# EAGLE design master (EAGLE 9.6.2)
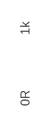
[diagram p0: schematic, sheet 1, part 1 of 2]
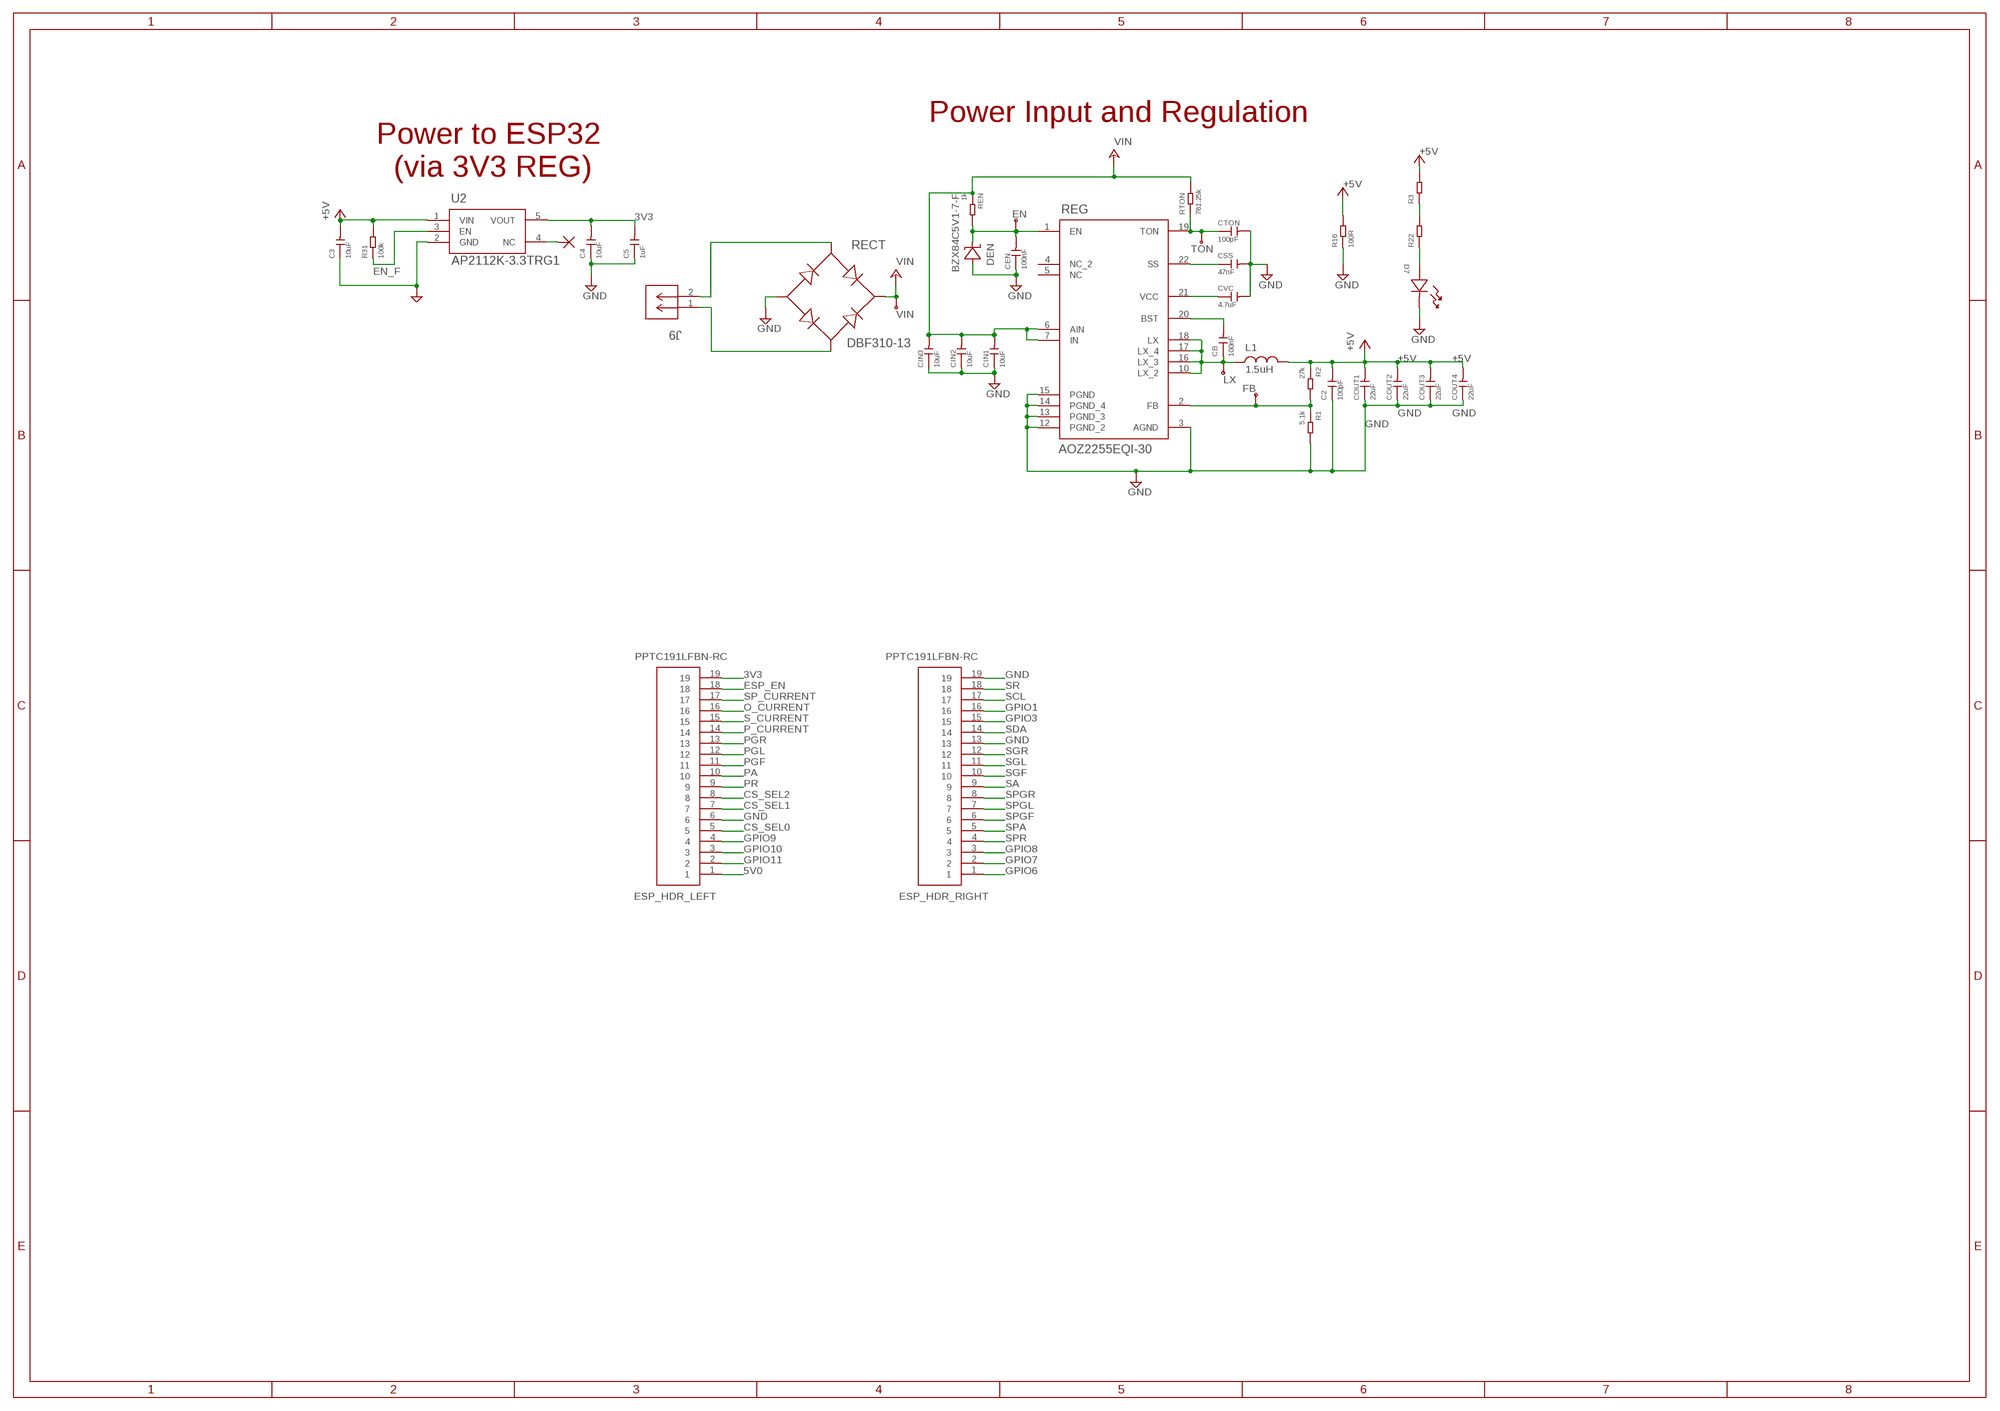
[diagram p1: schematic, sheet 1, part 2 of 2]

## Parts
C2  100pF  CERAMIC-1NF-50V-5%-C0G(0603)  [C0603]
C3  10uF  CERAMIC-4.7UF-25V-10%-X5R(0805)  [C0805]
C4  10uF  CERAMIC-4.7UF-25V-10%-X5R(0805)  [C0805]
C5  1uF  CERAMIC-1NF-50V-10%-X7R(0603)  [C0603]
CB  100nF  CERAMIC-1NF-50V-5%-C0G(0603)  [C0603]
CEN  100nF  CERAMIC-1NF-50V-5%-C0G(0603)  [C0603]
CIN1  10uF  CERAMIC-4.7UF-25V-10%-X5R(0805)  [C0805]
CIN2  10uF  CERAMIC-4.7UF-25V-10%-X5R(0805)  [C0805]
CIN3  10uF  CERAMIC-4.7UF-25V-10%-X5R(0805)  [C0805]
COUT1  22uF  CERAMIC-10UF-25V-10%-X5R(1206)  [C1206]
COUT2  22uF  CERAMIC-10UF-25V-10%-X5R(1206)  [C1206]
COUT3  22uF  CERAMIC-10UF-25V-10%-X5R(1206)  [C1206]
COUT4  22uF  CERAMIC-10UF-25V-10%-X5R(1206)  [C1206]
CSS  47nF  CERAMIC-1NF-50V-10%-X7R(0603)  [C0603]
CTON  100pF  CERAMIC-1.5PF-50V-0.1PF-NPO(0402)  [C0402]
CVC  4.7uF  CERAMIC-390PF-50V-10%-X7R(0402)  [C0402]
D7  VLMY1500-GS08  [LED_1500-GS08_VIS]
DEN  BZX84C5V1-7-F  ZENER_SOT23  [SOT23]
EN  CONN_HDR_1POS_0.1  [1X1]
ESP_HDR_LEFT  PPTC191LFBN-RC  [RHDR19W80P0X254_1X19_4876X254X]
ESP_HDR_RIGHT  PPTC191LFBN-RC  [RHDR19W80P0X254_1X19_4876X254X]
FB  CONN_HDR_1POS_0.1  [1X1]
J9  1715250000  [CONN2_250000_WED]
L1  1.5uH  BCIH1367-2R2M  [BCIH1367-2R2M]
LX  CONN_HDR_1POS_0.1  [1X1]
R1  5.1k  SMD-RES-0R-1%-1/10W(0603)  [R0603]
R2  27k  SMD-RES-0R-1%-1/10W(0603)  [R0603]
R3  1k  SMD-RES-1.5K-1%-1/16W(0402)  [R0402]
R16  100R  DIP-RES-(PR-D2.7XL8.5MM)  [PR-D2.7XL8.5MM]
R22  0R  SMD-RES-1.5K-1%-1/16W(0402)  [R0402]
R31  100k  SMD-RES-1.5K-1%-1/16W(0402)  [R0402]
RECT  DBF310-13  [DBF_DIO]
REG  AOZ2255EQI-30  AOZ2255LQI-31  [QFN_4X4_22L-EP2_S_AOS]
REN  1k  SMD-RES-1.2K-1%-1/10W(0603)  [R0603]
RTON  781.25k  SMD-RES-0R-1%-1/10W(0603)  [R0603]
TON  CONN_HDR_1POS_0.1  [1X1]
U2  AP2112K-3.3TRG1  [SOT_RG1_DIO]
U$3  NC_MARKER  (no package)
VIN  CONN_HDR_1POS_0.1  [1X1]

## Nets
3V3: C4.2 C5.2 ESP_HDR_LEFT.19 U2.5(VOUT)
5V0: ESP_HDR_LEFT.1
+5V: C2.2 C3.2 COUT1.2 COUT2.2 COUT3.2 COUT4.2 L1.P$2 R2.1 R3.2 R16.2 R31.2 U2.1(VIN)
+12V: J9.2 RECT.2
BST: CB.2 REG.20(BST)
CS_SEL0: ESP_HDR_LEFT.5
CS_SEL1: ESP_HDR_LEFT.7
CS_SEL2: ESP_HDR_LEFT.8
EN: CEN.2 DEN.P$3(C) EN.1 REG.1(EN) REN.2
EN_F: R31.1 U2.3(EN)
ESP_EN: ESP_HDR_LEFT.18
FB: FB.1 R1.1 R2.2 REG.2(FB)
GND: C2.1 C3.1 C4.1 C5.1 CEN.1 CIN1.1 CIN2.1 CIN3.1 COUT1.1 COUT2.1 COUT3.1 COUT4.1 CSS.2 CTON.2 CVC.2 D7.1 DEN.P$1(A) ESP_HDR_LEFT.6 ESP_HDR_RIGHT.13 ESP_HDR_RIGHT.19 R1.2 R16.1 RECT.3 REG.3(AGND) REG.12(PGND_2) REG.13(PGND_3) REG.14(PGND_4) REG.15(PGND) U2.2(GND)
GPIO1: ESP_HDR_RIGHT.16
GPIO3: ESP_HDR_RIGHT.15
GPIO6: ESP_HDR_RIGHT.1
GPIO7: ESP_HDR_RIGHT.2
GPIO8: ESP_HDR_RIGHT.3
GPIO9: ESP_HDR_LEFT.4
GPIO10: ESP_HDR_LEFT.3
GPIO11: ESP_HDR_LEFT.2
LX: CB.1 L1.P$1 LX.1 REG.10(LX_2) REG.16(LX_3) REG.17(LX_4) REG.18(LX)
N$2: R3.1 R22.2
N$3: D7.2 R22.1
N$8: U2.4(NC) U$3.P$1
N$9: J9.1 RECT.4
O_CURRENT: ESP_HDR_LEFT.16
P_CURRENT: ESP_HDR_LEFT.14
PA: ESP_HDR_LEFT.10
PGF: ESP_HDR_LEFT.11
PGL: ESP_HDR_LEFT.12
PGR: ESP_HDR_LEFT.13
PR: ESP_HDR_LEFT.9
S_CURRENT: ESP_HDR_LEFT.15
SA: ESP_HDR_RIGHT.9
SCL: ESP_HDR_RIGHT.17
SDA: ESP_HDR_RIGHT.14
SGF: ESP_HDR_RIGHT.10
SGL: ESP_HDR_RIGHT.11
SGR: ESP_HDR_RIGHT.12
SP_CURRENT: ESP_HDR_LEFT.17
SPA: ESP_HDR_RIGHT.5
SPGF: ESP_HDR_RIGHT.6
SPGL: ESP_HDR_RIGHT.7
SPGR: ESP_HDR_RIGHT.8
SPR: ESP_HDR_RIGHT.4
SR: ESP_HDR_RIGHT.18
SS: CSS.1 REG.22(SS)
TON: CTON.1 REG.19(TON) RTON.1 TON.1
VCC: CVC.1 REG.21(VCC)
VIN: CIN1.2 CIN2.2 CIN3.2 RECT.1 REG.6(AIN) REG.7(IN) REN.1 RTON.2 VIN.1
Unconnected: REG.4(NC_2) REG.5(NC)

## Notes on the sheet
- Power Input and Regulation
- Power to ESP32 
  (via 3V3 REG)

## Library data of the parts
C2 CB CEN = OPL_Capacitor:CERAMIC-1NF-50V-5%-C0G(0603): 302010341; MPN: GRM1885C1H102JA01D; VALUE: 1nf
C3 C4 CIN1-CIN3 = OPL_Capacitor:CERAMIC-4.7UF-25V-10%-X5R(0805): 302010146; MPN: CC0805KKX5R8BB475; VALUE: 4.7uf
C5 CSS = OPL_Capacitor:CERAMIC-1NF-50V-10%-X7R(0603): 302010141; MPN: CC0603KRX7R9BB102; VALUE: 1nf
COUT1-COUT4 = OPL_Capacitor:CERAMIC-10UF-25V-10%-X5R(1206): 302010181; MPN: CC1206KKX5R8BB106; VALUE: 10uf
CTON = OPL_Capacitor:CERAMIC-1.5PF-50V-0.1PF-NPO(0402): 302010023; MPN: CC0402BRNPO9BN1R5; VALUE: 1.5PF
CVC = OPL_Capacitor:CERAMIC-390PF-50V-10%-X7R(0402): 302010260; MPN: CC0402KRX7R9BB391; VALUE: 390PF 50V
D7 = ML_library:VLMY1500-GS08; COPYRIGHT: Copyright (C) 2022 Ultra Librarian. All rights reserved.; DIGI-KEY_PART_NUMBER_1: VLMY1500-GS08TR-ND; DIGI-KEY_PART_NUMBER_2: VLMY1500-GS08CT-ND; DIGI-KEY_PART_NUMBER_3: VLMY1500-GS08DKR-ND; MANUFACTURER_PART_NUMBER: VLMY1500-GS08; MFR_NAME: Vishay
DEN = ML_library:ZENER_SOT23
EN FB LX TON VIN = ML_library:CONN_HDR_1POS_0.1: 1x1 0.1" header pin
ESP_HDR_LEFT ESP_HDR_RIGHT = PPTC191LFBN-RC:PPTC191LFBN-RC: CONN HEADER FEMALE 19POS.1" TIN Source: Datasheet <https://drawings-pdf.s3.amazonaws.com/10492.pdf>; DESCRIPTION: CONN HEADER FEMALE 19POS.1" TIN; HEIGHT: 8.7mm; MANUFACTURER_NAME: Sullins; MANUFACTURER_PART_NUMBER: PPTC191LFBN-RC
J9 = 1715250000-2pin_screw_terminal_block:1715250000; COPYRIGHT: Copyright (C) 2023 Ultra Librarian. All rights reserved.; DIGIKEY_PART_NUMBER_1: 281-1414-ND; MANUFACTURER_PART_NUMBER: 1715250000; MFR_NAME: Weidmuller
L1 = ML_library:BCIH1367-2R2M: BCIH1367-2R2M JLC Part #: C237973 2.2uH, 22A, 4.2mOhms, 13.4x12.6mm
R1 R2 RTON = OPL_Resistor:SMD-RES-0R-1%-1/10W(0603): 301012029; MPN: RC0603FR-071K5L; VALUE: 1.5K
R3 R31 = OPL_Resistor:SMD-RES-1.5K-1%-1/16W(0402): 301011987; MPN: RC0402JR-070RL; VALUE: 0R
R16 = ML_library:DIP-RES-(PR-D2.7XL8.5MM): 301020000; MPN: FHCFR-1/4W-102J; VALUE: 1K
R22 = OPL_Resistor:SMD-RES-1.5K-1%-1/16W(0402): 301011987; MPN: RC0402JR-070RL
RECT = ML_library:DBF310-13; COPYRIGHT: Copyright (C) 2022 Ultra Librarian. All rights reserved.; DIGI-KEY_PART_NUMBER_1: DBF310-13DITR-ND; DIGI-KEY_PART_NUMBER_2: DBF310-13DICT-ND; DIGI-KEY_PART_NUMBER_3: DBF310-13DIDKR-ND; MANUFACTURER_PART_NUMBER: DBF310-13; MFR_NAME: Diodes Inc
REG = ML_library:AOZ2255LQI-31; COPYRIGHT: Copyright (C) 2022 Ultra Librarian. All rights reserved.; DIGI-KEY_PART_NUMBER_1: 785-AOZ2255LQI-31TR-ND; DIGI-KEY_PART_NUMBER_2: 785-AOZ2255LQI-31CT-ND; DIGI-KEY_PART_NUMBER_3: 785-AOZ2255LQI-31DKR-ND; MANUFACTURER_PART_NUMBER: AOZ2255LQI-31; MFR_NAME: Alpha and Omega Semiconductor
REN = OPL_Resistor:SMD-RES-1.2K-1%-1/10W(0603): 301012041; MPN: RC0603FR-071K5L; VALUE: 1.5K
U2 = ML_library:AP2112K-3.3TRG1; COPYRIGHT: Copyright (C) 2022 Ultra Librarian. All rights reserved.; DIGI-KEY_PART_NUMBER_1: AP2112K-3.3TRG1DICT-ND; DIGI-KEY_PART_NUMBER_2: AP2112K-3.3TRG1DIDKR-ND; DIGI-KEY_PART_NUMBER_3: AP2112K-3.3TRG1DITR-ND; MANUFACTURER_PART_NUMBER: AP2112K-3.3TRG1; MFR_NAME: Diodes Inc
U$3 = NC_MARKER:NC_MARKER

## Board
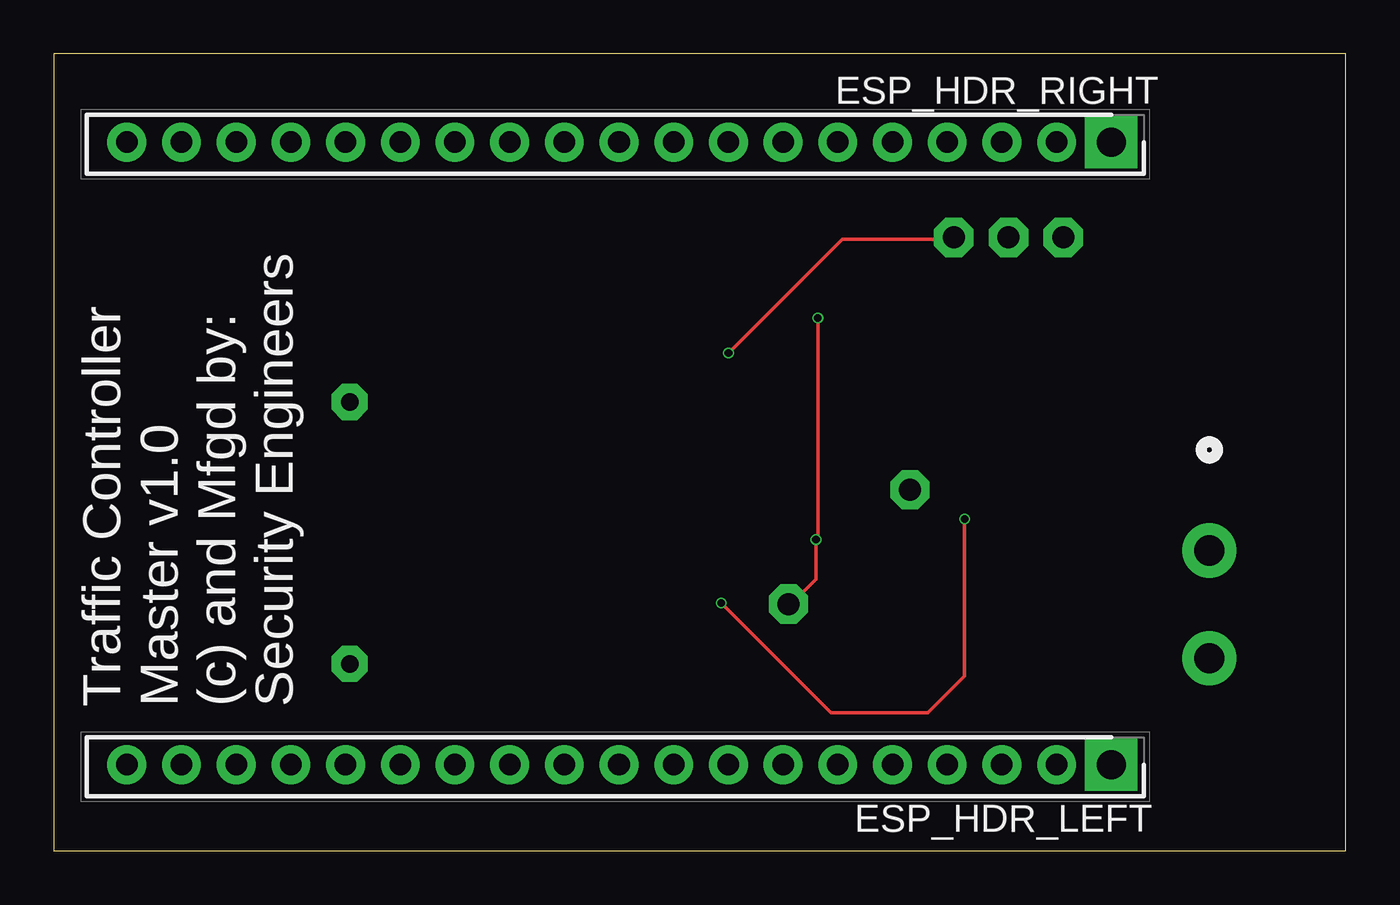
[diagram p2: board, top side]
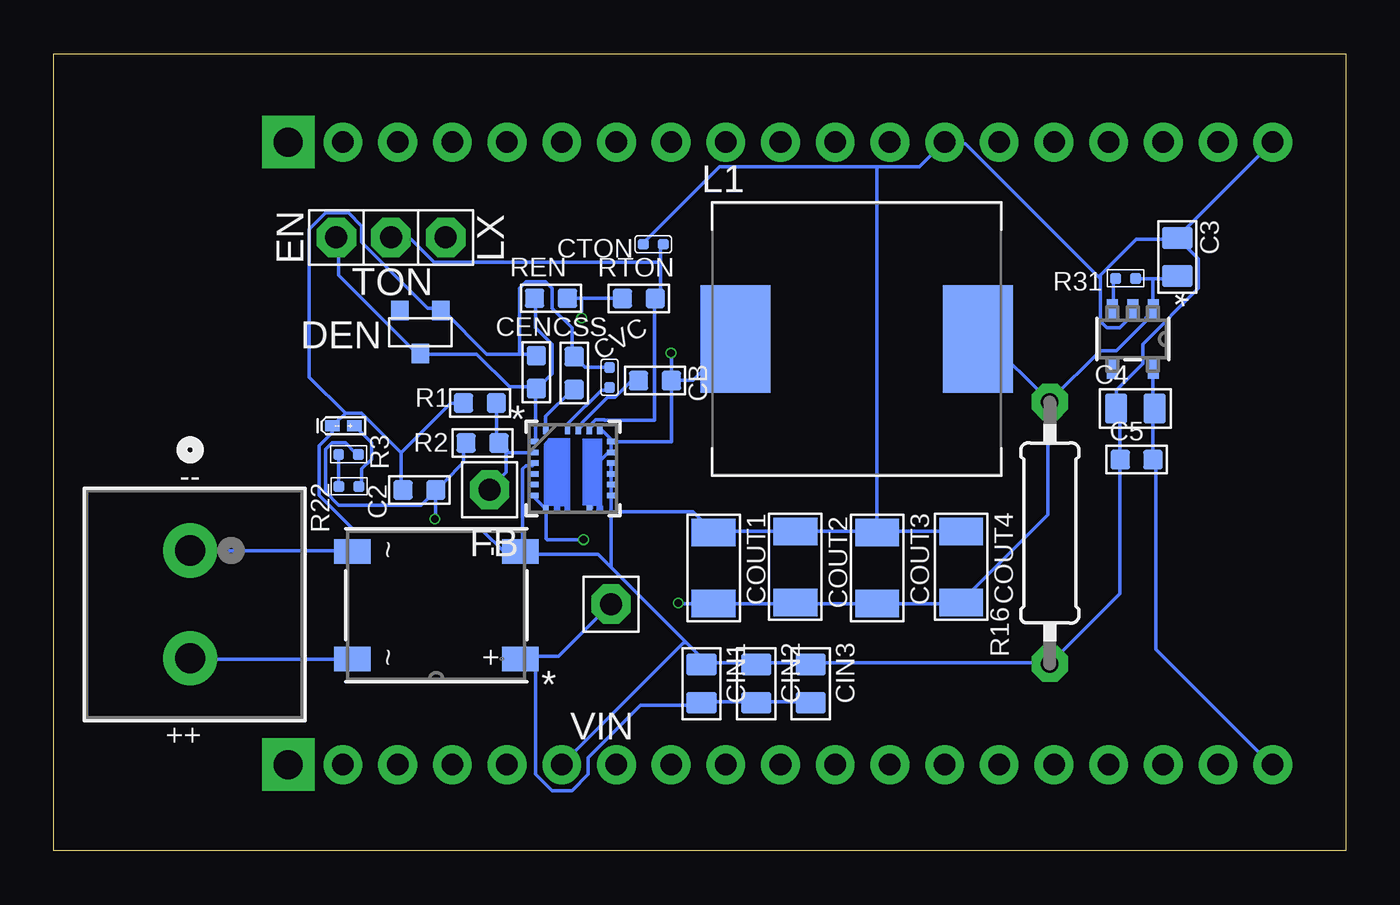
[diagram p3: board, bottom side, seen from below]

Size 60 x 37 mm. Coordinates in mm from the lower left corner, seen from the top.
Outline: 0,0 60,0 60,37 0,37 0,0
Copper layers (1*16): Top 0.035mm / dielectric 1.6mm / Bottom 0.035mm
Design rules "jlcpcb-2layers": minimum track width 5mil, minimum drill 0.3mm, track to track 5mil, track to pad 5mil, pad to pad 5mil, via to via 5mil, smd to smd 5mil, copper to edge 0.2mm, drill to drill 6mil, minimum pad ring 10mil, minimum via ring 3mil, stop-mask expansion 4mil, vias tented up to drill 0mil, thermal gap 10mil

### Footprints (pad centres in the part's own frame; a part is rotated, then mirrored left to right if it is on the bottom)
C0603 = smd 0.889 x 0.889: 1 0,0.762; 2 0,-0.762
C0805 = smd 1.397 x 1.016: 1 0,0.889; 2 0,-0.889
C1206 = smd 1.27 x 2.032: 1 -1.651,0; 2 1.651,0
C0402 = smd 0.5 x 0.5: 1 0,0.463; 2 0,-0.463
LED_1500-GS08_VIS = smd 0.686 x 0.508: 1 -0.508,0; 2 0.508,0
SOT23 = smd 0.8 x 0.9: P$1 -0.95,-1; P$2 0.95,-1; P$3 0,1
1X1 = drill 1.016 pad 1.778 octagon: 1 0,0
RHDR19W80P0X254_1X19_4876X254X = drill 1.35 pad 2.025 square: 1 0,0 | drill 1 pad 1.778: 2 2.54,0; 3 5.08,0; 4 7.62,0; 5 10.16,0; 6 12.7,0; 7 15.24,0; 8 17.78,0; 9 20.32,0; 10 22.86,0; 11 25.4,0; 12 27.94,0; 13 30.48,0; 14 33.02,0; 15 35.56,0; 16 38.1,0; 17 40.64,0; 18 43.18,0; 19 45.72,0
CONN2_250000_WED = drill 1.397 pad 1.905: 1 0,0; 2 5.004,0
BCIH1367-2R2M = smd 3.25 x 5: P$1 -5.625,0; P$2 5.625,0
R0603 = smd 0.889 x 0.889: 1 0,0.762; 2 0,-0.762
R0402 = smd 0.5 x 0.5: 1 0,0.463; 2 0,-0.463
PR-D2.7XL8.5MM = drill 0.813 pad 1.676 octagon: 1 -5.953,0; 2 6.207,0
DBF_DIO = smd 1.702 x 1.143: 1 -3.899,2.5; 2 3.899,2.5; 3 -3.899,-2.5; 4 3.899,-2.5
QFN_4X4_22L-EP2_S_AOS = smd 0.457 x 0.254: 1 -1.82,1.25; 2 -1.82,0.75; 3 -1.82,0.25; 4 -1.82,-0.25; 5 -1.82,-0.75; 6 -1.82,-1.25; 12 1.82,-1.25; 13 1.82,-0.75; 14 1.82,-0.25; 15 1.82,0.25; 16 1.82,0.75; 17 1.82,1.25 | smd 0.254 x 0.33: 7 -1.25,-1.884; 10 0.75,-1.884 | smd 0.254 x 0.457: 18 1.25,1.82; 19 0.75,1.82; 20 0.25,1.82; 21 -0.25,1.82; 22 -1.25,1.82
SOT_RG1_DIO = smd 1.003 x 0.508: 1 -1.353,0.95; 2 -1.353,0; 3 -1.353,-0.95; 4 1.353,-0.95; 5 1.353,0.95

### Placement (x,y rotation side)
C2  43.02,16.75 90 bottom
C3  7.82,27.57 0 bottom
C4  9.77,20.53 90 bottom
C5  9.71,18.16 90 bottom
CB  32.08,21.83 270 bottom
CEN  37.59,22.22 0 bottom
CIN1  29.92,7.76 0 bottom
CIN2  27.38,7.76 0 bottom
CIN3  24.84,7.76 0 bottom
COUT1  29.36,13.13 270 bottom
COUT2  25.56,13.18 270 bottom
COUT3  21.76,13.13 270 bottom
COUT4  17.86,13.18 270 bottom
CSS  35.83,22.18 180 bottom
CTON  32.16,28.16 270 bottom
CVC  34.19,21.98 180 bottom
D7  46.55,19.73 0 bottom
DEN  42.98,24.08 180 bottom
EN  46.88,28.48 180 bottom
ESP_HDR_LEFT  49.11,4 180 top
ESP_HDR_RIGHT  49.11,32.9 180 top
FB  39.76,16.76 180 bottom
J9  53.67,13.94 270 bottom
L1  22.71,23.76 0 bottom
LX  41.8,28.48 180 bottom
R1  40.21,20.79 270 bottom
R2  40.09,18.93 90 bottom
R3  46.31,18.4 90 bottom
R16  13.74,14.63 90 bottom
R22  46.29,16.92 270 bottom
R31  10.22,26.57 90 bottom
RECT  42.24,11.4 180 bottom
REG  35.89,17.75 0 bottom
REN  36.91,25.65 270 bottom
RTON  32.83,25.64 270 bottom
TON  44.34,28.48 180 bottom
U2  9.89,23.76 270 bottom
VIN  34.12,11.45 180 bottom

### Tracks (layer width: path | path; a pad name or v marks a point on that pad's centre or on a via)
3V3
  Bottom 0.152: U2.5 8.97,22.3 8.97,20.62 C4.2 8.97,20.47 8.97,18.19 C5.2 8.81,18.03 8.81,9.35 3.48,4.01 ESP_HDR_LEFT.19
+5V  (via drill 0.35)
  Top 0.152: v42.3,15.4 42.3,8.1 40.6,6.4 36.1,6.4 v31,11.5
  Bottom 0.152: 8.97,26.57 7.9,26.57 C3.2 | 8.97,26.57 9.73,26.57 R31.2 | 8.97,26.57 8.97,25.2 U2.1 8.97,25.04 9.27,24.74 9.27,24.59 10.64,23.22 11.4,23.22 13.69,20.93 R16.2 | L1.P$2 17.04,23.67 16.59,23.67 13.84,20.93 R16.2 | R3.2 46,18.49 46.46,18.95 47.07,18.95 47.37,18.64 47.37,16.66 46.76,16.05 42.95,16.05 42.34,16.66 C2.2 | 41.88,17.12 42.19,16.81 C2.2 | 41.88,17.12 40.97,18.03 40.97,18.8 R2.1 | COUT1.2 29.24,11.48 25.58,11.48 COUT2.2 25.42,11.48 COUT3.2 21.61,11.48 17.96,11.48 COUT4.2 17.81,11.63 13.84,15.59 13.84,20.78 R16.2 | 41.88,17.12 C2.2 | 29.39,11.48 COUT1.2 | C2.2 42.26,15.44 v42.3,15.4 | v31,11.5 30.98,11.48 COUT1.2
+12V
  Bottom 0.152: RECT.2 46.15,8.89 53.62,8.89 J9.2
BST
  Bottom 0.152: REG.20 35.47,19.74 35.47,19.88 34.29,21.06 33.93,21.06 33.16,21.83 CB.2
EN
  Bottom 0.152: REG.1 37.62,19.1 37.62,21.39 CEN.2 | REN.2 37.62,25.5 37.62,24.28 36.85,23.52 36.85,22.15 37.47,21.54 CEN.2 | CEN.2 37.62,21.54 38.84,21.54 40.36,23.06 42.95,23.06 DEN.P$3 43.1,23.06 46.76,26.72 46.76,28.4 EN.1
EN_F
  Bottom 0.152: R31.1 10.8,26.57 10.8,25.2 U2.3
FB
  Bottom 0.152: 38.99,18.49 37.77,18.49 REG.2 | 38.99,18.49 39.29,18.8 R2.2 | R1.1 39.45,20.78 39.45,18.95 R2.2 | 38.99,18.49 38.99,17.58 39.75,16.81 FB.1 | 38.99,18.49 R2.2
GND
  Bottom 0.152: REG.15 34.11,17.88 34.11,17.58 REG.14 34.11,17.42 34.11,17.12 REG.13 34.11,16.97 34.11,16.51 | 34.11,16.51 34.11,15.75 | REG.3 37.77,17.88 38.07,17.88 38.23,17.73 38.23,14.09 38.4,13.92 | 34.11,16.51 REG.12 | 21.77,14.83 25.42,14.83 COUT2.1 25.58,14.83 29.24,14.83 COUT1.1 29.39,14.83 30.3,15.75 34.11,15.75 | COUT4.1 17.96,14.83 21.61,14.83 COUT3.1 21.77,14.83 | 21.77,31.75 19.79,31.75 18.72,32.82 ESP_HDR_RIGHT.13 18.57,32.82 17.65,32.82 11.4,26.57 | 21.77,31.75 29.08,31.75 32.59,28.24 CTON.2 | 11.4,26.57 11.4,26.72 9.73,28.4 7.9,28.4 C3.1 | 11.4,26.57 11.4,24.59 11.1,24.28 10.49,24.28 10.03,24.74 10.03,25.04 U2.2 | C3.1 7.75,28.4 6.83,27.48 6.83,26.11 9.42,23.52 9.42,22.6 10.64,21.39 10.64,20.62 C4.1 10.64,20.47 10.49,20.32 10.49,18.19 C5.1 10.49,18.03 10.49,11.94 13.69,8.74 R16.1 13.84,8.74 24.82,8.74 CIN3.1 24.97,8.74 27.25,8.74 CIN2.1 27.41,8.74 29.69,8.74 | ESP_HDR_RIGHT.19 3.48,32.82 7.75,28.55 C3.1 | 21.77,31.75 21.77,14.83 | CVC.2 34.26,22.45 35.33,22.45 35.79,22.91 CSS.2 35.94,23.06 35.94,24.28 36.85,25.2 36.85,26.11 37.16,26.41 38.07,26.41 38.38,26.11 38.38,23.06 | 38.38,23.06 39.9,23.06 41.88,25.04 DEN.P$1 42.04,25.2 42.65,25.2 45.69,28.24 45.69,29.01 46.3,29.62 47.37,29.62 48.13,28.85 48.13,22 46.46,20.32 | 38.38,23.06 37.62,23.06 CEN.1 | 46.46,20.32 46.91,19.86 D7.1 47.07,19.71 47.07,19.41 47.68,18.8 47.68,16.51 46,14.83 40.06,14.83 39.14,13.92 38.4,13.92 | 46.46,20.32 45.69,20.32 43.87,18.49 | 43.87,18.49 43.87,16.81 C2.1 | 43.87,18.49 41.58,20.78 41.12,20.78 R1.2 | 29.69,8.74 29.84,8.74 CIN1.1 29.69,8.74 | 29.69,8.74 30.61,9.65
  Bottom 0.152: 30.61,9.65 34.11,13.16 | 34.11,13.16 34.72,13.77 38.23,13.77 RECT.3 38.38,13.92 38.4,13.92 | 30.61,9.65 30.76,9.65 36.4,4.01 ESP_HDR_LEFT.6 | 34.11,15.75 34.11,13.16
LX  (via drill 0.35)
  Top 0.152: v31.34,23.11 36.62,28.4 41.73,28.4 LX.1
  Bottom 0.152: 34.11,18.49 34.11,18.95 REG.17 | REG.18 34.57,19.56 34.11,19.1 REG.17 | 34.11,18.49 34.26,18.49 35.03,17.73 35.03,15.9 REG.10 | 34.11,18.49 REG.16 | CB.1 31.22,21.84 30.3,21.84 28.47,23.67 L1.P$1 | REG.17 31.32,19 CB.1 | v31.34,23.11 31.32,23.09 CB.1
N$2
  Bottom 0.152: R22.2 46.76,16.97 46.76,18.34 R3.1
N$3
  Bottom 0.152: R22.1 45.69,16.97 45.69,17.73 45.24,18.19 45.24,18.95 46,19.71 D7.2
N$9
  Bottom 0.152: RECT.4 46.15,13.92 53.62,13.92 J9.1
SS
  Bottom 0.152: REG.22 37.16,19.71 37.16,20.17 35.94,21.39 CSS.1
TON
  Bottom 0.152: 32.13,25.5 RTON.1 | 31.83,27.33 31.83,25.81 31.98,25.65 RTON.1 | 31.83,27.33 31.83,28.09 CTON.1 | 31.83,27.33 42.34,27.33 43.41,28.4 44.32,28.4 TON.1 | REG.19 34.97,19.74 34.97,19.88 34.85,20 34.43,20 32.1,20 32.1,25.54 32.11,25.55 32.11,25.6 RTON.1
VCC
  Bottom 0.152: REG.21 36.09,19.71 36.09,19.86 34.57,21.39 34.26,21.39 CVC.1
VIN  (via drill 0.35)
  Top 0.152: VIN.1 34.26,11.48 35.4,12.61 v35.4,14.45 35.48,14.53 v35.48,24.74
  Bottom 0.152: CIN3.2 24.97,6.91 27.25,6.91 CIN2.2 27.41,6.91 29.84,6.91 CIN1.2 30,6.76 32.74,6.76 35.18,4.32 35.18,3.55 35.94,2.79 36.85,2.79 37.62,3.55 37.62,9.04 | 35.48,25.65 36.09,25.65 REN.1 | 35.48,25.65 33.66,25.65 RTON.2 | 37.62,16.51 REG.6 37.71,16.44 REG.7 37.14,14.49 37.1,14.45 v35.4,14.45 | 37.62,9.04 36.55,9.04 34.26,11.33 VIN.1 | 37.62,9.04 38.23,9.04 RECT.1 37.62,9.04 | v35.48,24.74 35.48,25.65

### Text on the board
tNames: Traffic Controller / Master v1.0 / (c) and Mfgd by: / Security Engineers
bNames: -- | ++